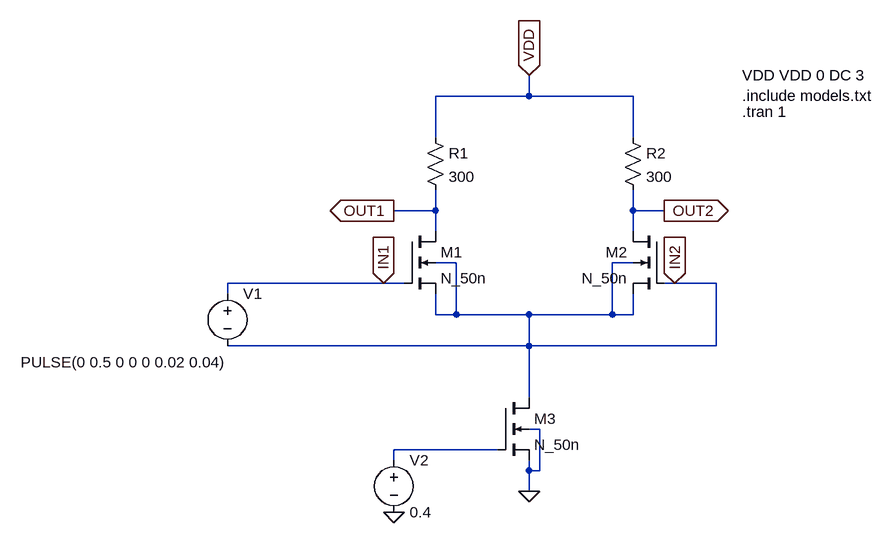
[diagram p0: schematic diffampr.asc]
diffampr.asc, the LTspice schematic file:
Version 4.1
SHEET 1 880 680
WIRE 224 0 224 -32
WIRE 224 0 80 0
WIRE 384 0 224 0
WIRE 80 64 80 0
WIRE 384 64 384 0
WIRE 80 176 80 144
WIRE 80 176 16 176
WIRE 384 176 384 144
WIRE 432 176 384 176
WIRE 80 208 80 176
WIRE 384 208 384 176
WIRE 112 256 80 256
WIRE 384 256 352 256
WIRE 0 288 -240 288
WIRE 32 288 0 288
WIRE 448 288 432 288
WIRE 512 288 448 288
WIRE -240 304 -240 288
WIRE 80 336 80 304
WIRE 112 336 112 256
WIRE 112 336 80 336
WIRE 224 336 112 336
WIRE 352 336 352 256
WIRE 352 336 224 336
WIRE 384 336 384 304
WIRE 384 336 352 336
WIRE 224 384 224 336
WIRE 224 384 -240 384
WIRE 512 384 512 288
WIRE 512 384 224 384
WIRE 224 464 224 384
WIRE 240 512 224 512
WIRE 176 544 16 544
WIRE 16 560 16 544
WIRE 224 576 224 560
WIRE 240 576 240 512
WIRE 240 576 224 576
WIRE 224 608 224 576
FLAG 224 608 0
FLAG 16 640 0
FLAG 0 288 IN1
IOPIN 0 288 In
FLAG 448 288 IN2
IOPIN 448 288 In
FLAG 16 176 OUT1
IOPIN 16 176 Out
FLAG 432 176 OUT2
IOPIN 432 176 Out
FLAG 224 -32 VDD
IOPIN 224 -32 In
SYMBOL nmos4 32 208 R0
SYMATTR InstName M1
SYMATTR Value N_50n
SYMATTR Value2 l=0.1u w=100u
SYMBOL nmos4 432 208 M0
SYMATTR InstName M2
SYMATTR Value N_50n
SYMATTR Value2 l=0.1u w=100u
SYMBOL res 64 48 R0
SYMATTR InstName R1
SYMATTR Value 300
SYMBOL res 368 48 R0
SYMATTR InstName R2
SYMATTR Value 300
SYMBOL nmos4 176 464 R0
SYMATTR InstName M3
SYMATTR Value N_50n
SYMATTR Value2 l=0.1u w=300u
SYMBOL voltage -240 288 R0
WINDOW 3 -318 121 Left 2
WINDOW 123 0 0 Left 0
WINDOW 39 0 0 Left 0
SYMATTR InstName V1
SYMATTR Value PULSE(0 0.5 0 0 0 0.02 0.04)
SYMBOL voltage 16 544 R0
WINDOW 123 0 0 Left 0
WINDOW 39 0 0 Left 0
SYMATTR InstName V2
SYMATTR Value 0.4
TEXT 552 -32 Left 2 !VDD VDD 0 DC 3\n.include models.txt
TEXT 552 24 Left 2 !.tran 1

The netlist it stands for:
* diffampr.asc
M1 OUT1 IN1 IN2 IN2 N_50n l=0.1u w=100u
M2 OUT2 IN2 IN2 IN2 N_50n l=0.1u w=100u
R1 VDD OUT1 300
R2 VDD OUT2 300
M3 IN2 N001 0 0 N_50n l=0.1u w=300u
V1 IN1 IN2 PULSE(0 0.5 0 0 0 0.02 0.04)
V2 N001 0 0.4
.model NMOS NMOS
.model PMOS PMOS
.lib standard.mos
VDD VDD 0 DC 3
.include models.txt
.tran 1
.backanno
.end